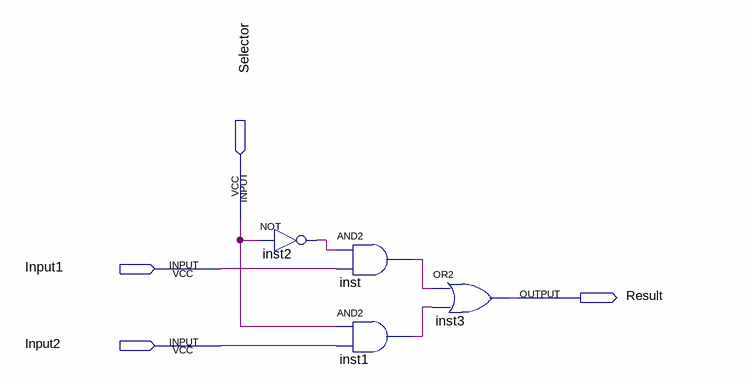
[diagram p0: schematic sheet]
// Quartus schematic mux2_1bit.bdf as structural Verilog: 4 symbols, 4 pins
module mux2_1bit (
  input  Selector,
  input  Input1,
  input  Input2,
  output Result
);

  wire inst1_out, inst2_out, inst_out;

  not inst2 (inst2_out, Selector);
  and inst (inst_out, inst2_out, Input1);
  and inst1 (inst1_out, Selector, Input2);
  or inst3 (Result, inst_out, inst1_out);
endmodule
